# Altium schematic sheet 02_Connectors.SchDoc: Off Board Connectors
size A; Revision: A; SheetNumber: 2; SheetTotal: 4; ECE315_Project_Name: ECE453 F23 Base Project
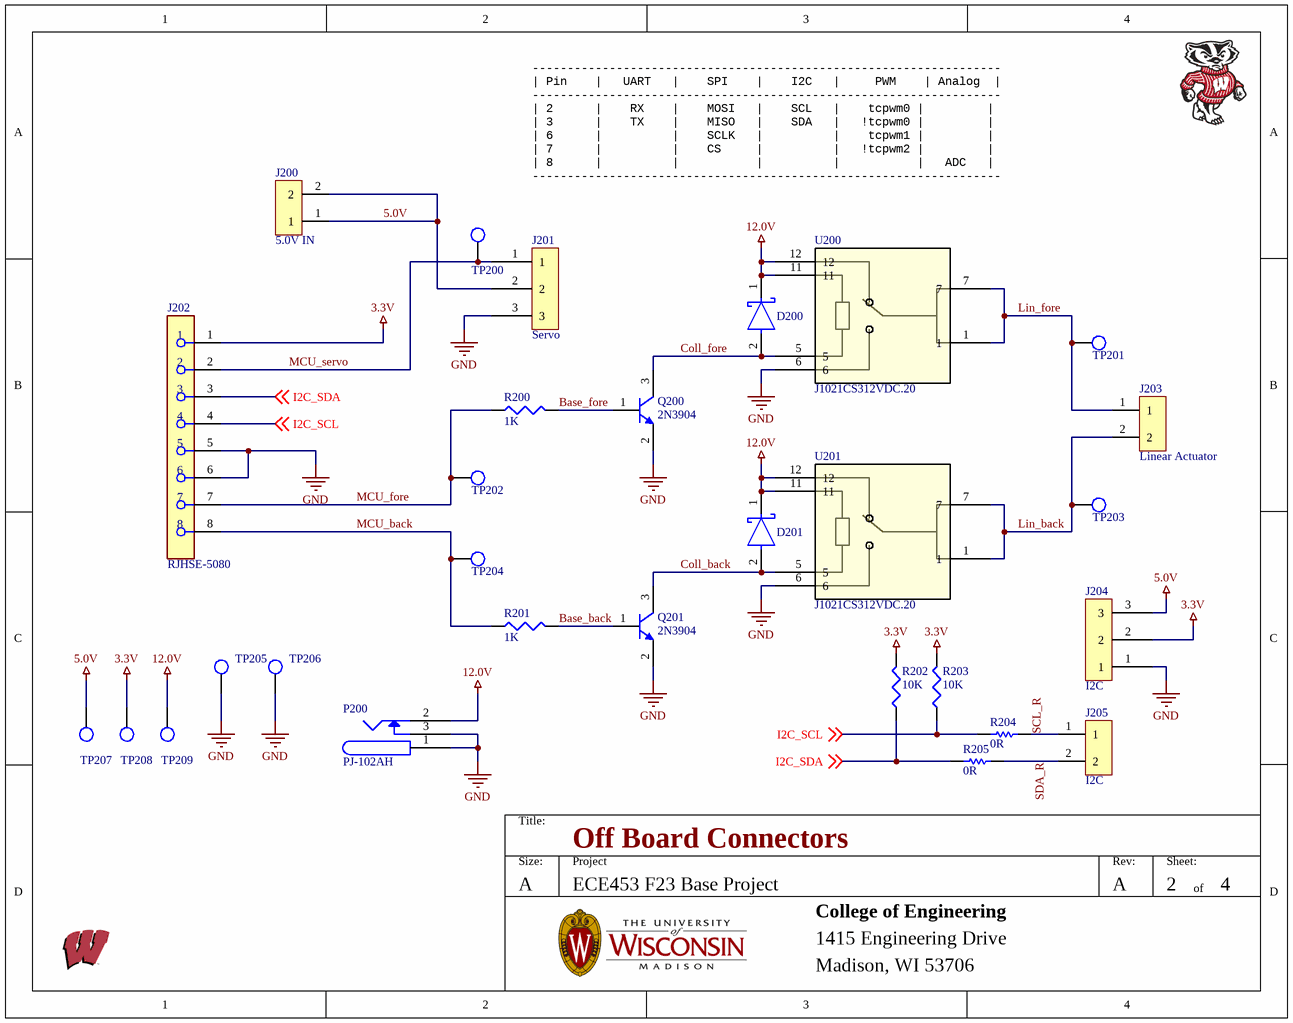
[diagram p0: 02_Connectors.SchDoc]

## Parts
D200  SM5817PL-TP  [On_Semiconductor_425-04_IPC_A]  (value not drawn)
D201  SM5817PL-TP  [On_Semiconductor_425-04_IPC_A]  (value not drawn)
J200  5.0V IN  [PHOENIX2X0.2]
J201  Servo  [PHOENIX3X0.2]
J202  RJHSE-5080  [FP-RJHSE-5080-MFG]
J203  Linear Actuator  [PHOENIX2X0.2]
J204  I2C  [PHOENIX3X0.2]
J205  I2C  [PHOENIX2X0.2]
P200  Manufacturer Part Number: PJ-102AH  [PJ-102]  (hidden comment: PJ-102)
Q200  2N3904  [SOT23-3M]
Q201  2N3904  [SOT23-3M]
R200  value 1K  [RESC2012M]  (hidden comment: 10K)
R201  value 1K  [RESC2012M]  (hidden comment: 10K)
R202  10K  [RESC2012M]
R203  10K  [RESC2012M]
R204  value 0R  [RESC2013X70X40NL20T20]  (hidden comment: ERJ-6GEY0R00V)
R205  value 0R  [RESC2013X70X40NL20T20]  (hidden comment: ERJ-6GEY0R00V)
TP200  TP_1206  [TP-SMC-1206]  (value not drawn)
TP201  TP_1206  [TP-SMC-1206]  (value not drawn)
TP202  TP_1206  [TP-SMC-1206]  (value not drawn)
TP203  TP_1206  [TP-SMC-1206]  (value not drawn)
TP204  TP_1206  [TP-SMC-1206]  (value not drawn)
TP205  TP_1206  [TP-SMC-1206]  (value not drawn)
TP206  TP_1206  [TP-SMC-1206]  (value not drawn)
TP207  TP_1206  [TP-SMC-1206]  (value not drawn)
TP208  TP_1206  [TP-SMC-1206]  (value not drawn)
TP209  TP_1206  [TP-SMC-1206]  (value not drawn)
U200  J1021CS312VDC.20  [RELAY6_J1021CS312VDC.20_CRS]
U201  J1021CS312VDC.20  [RELAY6_J1021CS312VDC.20_CRS]

## Nets
3.3V: J202.1 J204.2 R202.2 R203.2 TP208.1
5.0V: J200.1 J200.2 J201.2 J204.3 TP207.1
12.0V: D200.1(C) D201.1(C) P200.2 TP209.1 U200.11 U200.12 U201.11 U201.12
GND: J201.3 J202.5 J202.6 J204.1 P200.1 P200.3 Q200.2(E) Q201.2(E) TP205.1 TP206.1 U200.6 U201.6
Base_back: Q201.1(B) R201.2
Base_fore: Q200.1(B) R200.2
Coll_back: D201.2(A) Q201.3(C) U201.5
Coll_fore: D200.2(A) Q200.3(C) U200.5
I2C_SCL: J202.4 R203.1 R204.1 ; off-sheet I2C_SCL
I2C_SDA: J202.3 R202.1 R205.1 ; off-sheet I2C_SDA
Lin_back: J203.2 TP203.1 U201.1 U201.7
Lin_fore: J203.1 TP201.1 U200.1 U200.7
MCU_back: J202.8 R201.1 TP204.1
MCU_fore: J202.7 R200.1 TP202.1
MCU_servo: J201.1 J202.2 TP200.1
SCL_R: J205.1 R204.2
SDA_R: J205.2 R205.2

## Notes on the sheet
- -------------------------------------------------------------------
  | Pin    |   UART   |    SPI    |    I2C   |     PWM    | Analog  |
  -------------------------------------------------------------------
  | 2      |    RX    |    MOSI   |    SCL   |    tcpwm0 |         |
  | 3      |    TX    |    MISO   |    SDA   |   !tcpwm0 |         |
  | 6      |          |    SCLK   |          |    tcpwm1 |         |
  | 7      |          |    CS     |          |   !tcpwm2 |         |
  | 8      |          |           |          |           |   ADC   |
  -------------------------------------------------------------------
- Title:
- Size:
- A
- Project
- Rev:
- Sheet:
- of
- College of Engineering
- 1415 Engineering Drive
- Madison, WI 53706

## Library data of the parts
D200 D201 = SM5817PL-TP: DIODE SCHOTTKY 20V 1A SOD123FL; Forward Voltage: 450mV; Max Surge Current: 30A; Element Configuration: Single; Manufacturer 2: MCC; Manufacturer Part Number 2: SM5817PL-TP; RoHS: Yes; Category: Rectifier Diodes; Stock 2: 178040; Pricing 2: 1=0.46000, 10=0.31900, 100=0.16110, 500=0.13144, 1000=0.09752 (USD); Mount: Surface Mount; Number of Pins: 2; Min Operating Temperature: -65°C; Max Operating Temperature: 125°C; Packaging: Tape and Reel; Package Quantity: 1; Average Rectified Current: 1A; Peak Non-Repetitive Surge Current: 30A; Max Reverse Voltage (DC): 20V; Reverse Voltage: 20V; Radiation Hardening: No; RoHS Compliant: Yes; ComponentLink1URL: https://datasheet.ciiva.com/15200/getdatasheetpartid-487494-15200581.pdf?src-supplier=Verical; ComponentLink1Description: https://datasheet.ciiva.com/15200/getdatasheetpartid-487494-15200581.pdf?src-supplier=Verical; ComponentLink2URL: https://datasheet.ciiva.com/912/sm5817pl-sm5819plsod-123fl-912827.pdf?src-supplier=Digi-Key; ComponentLink2Description: https://datasheet.ciiva.com/912/sm5817pl-sm5819plsod-123fl-912827.pdf?src-supplier=Digi-Key; Supplier 1: Digi-Key; Supplier Part Number 1: SM5817PL-TPMSCT-ND
J200 J203 J205 = 2-Pin: 2~24 Poles, Screw Type, Horizontal, 5.08 Pitch, 26~14 (AWG), Terminal Block Connector; Manufacturer: CUI Devices; Manufacturer Part Number: TB006-508-02BE; ComponentLink1URL: https://datasheet.ciiva.com/709/eng-cd-640456-w1-709680.pdf?src-supplier=Digi-Key; ComponentLink1Description: https://datasheet.ciiva.com/709/eng-cd-640456-w1-709680.pdf?src-supplier=Digi-Key; ComponentLink2URL: https://datasheet.ciiva.com/3118/eng-ds-82056-mta-0608-3118497.pdf?src-supplier=Avnet; ComponentLink2Description: https://datasheet.ciiva.com/3118/eng-ds-82056-mta-0608-3118497.pdf?src-supplier=Avnet; ComponentLink3URL: https://datasheet.ciiva.com/16401/eng-ds-82056-mta-0608-16401289.pdf?src-supplier=Future+Electronics; ComponentLink3Description: https://datasheet.ciiva.com/16401/eng-ds-82056-mta-0608-16401289.pdf?src-supplier=Future+Electronics; ComponentLink4URL: https://datasheet.ciiva.com/25617/0900766b80027008-25617244.pdf?src-supplier=RSComponents; ComponentLink4Description: https://datasheet.ciiva.com/25617/0900766b80027008-25617244.pdf?src-supplier=RSComponents; ComponentLink5URL: https://datasheet.ciiva.com/14156/04384301-14156820.pdf?src-supplier=Distrelec; ComponentLink5Description: https://datasheet.ciiva.com/14156/04384301-14156820.pdf?src-supplier=Distrelec; ComponentLink6URL: https://datasheet.ciiva.com/11746/0900766b80eb7fdd-11746365.pdf?src-supplier=RSComponents; ComponentLink6Description: https://datasheet.ciiva.com/11746/0900766b80eb7fdd-11746365.pdf?src-supplier=RSComponents; ComponentLink7URL: https://datasheet.ciiva.com/7128/1866390-7128742.pdf?src-supplier=Newark; ComponentLink7Description: https://datasheet.ciiva.com/7128/1866390-7128742.pdf?src-supplier=Newark; ComponentLink8URL: https://datasheet.ciiva.com/16505/eng-ds-82056-mta-0608-16505419.pdf?src-supplier=Avnet+Asia; ComponentLink8Description: https://datasheet.ciiva.com/16505/eng-ds-82056-mta-0608-16505419.pdf?src-supplier=Avnet+Asia; Supplier: Digi-Key; RoHS: Yes; Category: Terminal Blocks; Stock 1: 50889; Pricing 1: 1=0.86, 10=0.472, 25=0.3524, 50=0.3142, 100=0.308, 250=0.27108, 500=0.24644, 1000=0.2218, 5000=0.16635 (USD); Supplier Part Number: 102-6191-ND
J201 J204 = 3-Pin_2: 2~24 Poles, Screw Type, Horizontal, 5.08 Pitch, 26~14 (AWG), Terminal Block Connector; Manufacturer: CUI Devices; Manufacturer Part Number: TB006-508-03BE; Supplier 1: Digi-Key; Supplier Part Number 1: 102-6192-ND; RoHS: Yes; Category: Terminal Blocks; Stock 1: 41909; Pricing 1: 1=0.91, 10=0.567, 25=0.4856, 50=0.4364, 100=0.4272, 250=0.3636, 500=0.34542, 1000=0.30906, 5000=0.24179 (USD)
J202 = CMP-02366-000003-1: CONN MOD JACK 8P8C R/A UNSHLD; Manufacturer: Amphenol; Current Rating: 1.5A; Voltage Rating: 125V; Pitch: 1.02mm; Conn Orientation: Right Angle; Number Of Contacts: 8; Is Female: yes; Conn Gender: Female; Contact Resistance: 20mR; Number of Ports: 1; Connector Type: RJ45; Lead Free: Yes; Device Class L3: unset; Footprint Url: https://cdn.amphenol-icc.com/media/wysiwyg/files/drawing/rjhse5080.pdf?__cf_chl_jschl_tk__=e349db0bbbb6188a39347cd5e541b92fa02c9719-1587748343-0-AW7tChdeHzRPLX9gSWj7WrKaXQoY9BsmT9Ek0h-T62M9y3Rs9iypFcOtkzb-6sGYQEjFE-jcoNciDETCOZrh1rYyOesac5SvYLoLwHIsHvF4AKBlx-MXmfZUVk9OTTJLqyQq2qMm0PFRLJpNcK0nrKResqOniRSYixG2sPTmOPraH-ULJFBDL602CHqcI9KKBgTq90Jh1OL2Td4moJ99rFsJRJ1Tk_uoxGe8ublcP_ARu-uLpWcQrBcwOcHDTAwL29DAwVaqcH7ta8Ks7WMlHmVl_pILeEDwT0bE9vu5Pa5S3PtNRF1leuFkgi_FMbUxTDulc5xzbXSfng8srUIV1lWXny5nx1fZJEUa_w97yKjffzBMxiWLWVN-V7-uqAaPbyv_m-wRyw5O25OZNyJOeGU; ComponentLink2URL: https://cdn.amphenol-icc.com/media/wysiwyg/files/documentation/datasheet/inputoutput/io-modjack-rjhse.pdf; Device Class L1: Connectors; Package: CONN_MOD_JACK; Mouser Description: Modular Connectors / Ethernet Connectors R/A RJ45 NONSHIELDED 8 CONT NO LEDS; Manufacturer Part Number: RJHSE-5080; Octopart: https://octopart.com/rjhse-5080-amphenol-45060; Category: Conn; Height: 0.535inch; Temperature: -55°C to +85°C; Digikey Description: CONN MOD JACK 8P8C R/A UNSHLD; Device Class L2: Modular / Ethernet Connectors; Contact Material: Gold,Nickel; ComponentLink2Description: Datasheet; Temperature Range Low: -55°C; RoHS: TRUE; Automotive: No; Temperature Range High: +85°C; Supplier: Newark; Supplier Part Number: 28T0105; Stock: 8640; Pricing: 1=0.966, 10=0.854, 25=0.808, 50=0.777, 100=0.748, 250=0.688, 500=0.627, 1000=0.568 (USD); Mounting Technology: Through Hole,Panel; Contact Plating: Gold; Max Current Rating: 1.5A; Number of Positions Loaded: 8; Max Voltage Rating (AC): 125V; Orientation: Right Angle; Packaging: Rail/Tube; Gender: Female; Termination: Solder; Number of Positions: 8; Voltage Rating (DC): 125V; Length: 15.75mm; Depth: 14.99mm; Radiation Hardening: No; RoHS Compliant: Yes; Reach SVHC Compliant: Unknown; ComponentLink1URL: https://datasheet.ciiva.com/7629/1682821-7629402.pdf?src-supplier=Element14; ComponentLink1Description: https://datasheet.ciiva.com/7629/1682821-7629402.pdf?src-supplier=Element14; ComponentLink3URL: https://datasheet.ciiva.com/685/rjhse5080-685586.pdf?src-supplier=Digi-Key; ComponentLink3Description: https://datasheet.ciiva.com/685/rjhse5080-685586.pdf?src-supplier=Digi-Key; ComponentLink4URL: https://datasheet.ciiva.com/1432/1693748-1432448.pdf?src-supplier=Element14; ComponentLink4Description: https://datasheet.ciiva.com/1432/1693748-1432448.pdf?src-supplier=Element14; ComponentLink5URL: https://datasheet.ciiva.com/15171/getdatasheetpartid-643190-15171163.pdf?src-supplier=Verical; ComponentLink5Description: https://datasheet.ciiva.com/15171/getdatasheetpartid-643190-15171163.pdf?src-supplier=Verical
P200 = CONN JACK PWR W/SW: CONN PWR JACK 2.1X5.5MM HIGH CUR; Manufacturer: CUI Inc; Internal Switch(s): Single Switch, Normally Closed; Number of Positions/Contacts: 2 Conductors, 3 Contacts; Plug/Mating Plug Diameter: 2.1mm ID, 5.5mm OD; Gender: Male; Shielding: Unshielded; Voltage - Rated: 24VDC; Current Rating: 5A; Value: CP-102AD; Mounting Type: Through Hole, Right Angle; Supplier: Digi-Key; Connector Type: Jack; Supplier Part Number: CP-102AH-ND; Termination: Solder; Contact Material: Copper; Housing Material: Thermoplastic; Contact Material - Plating: Nickel; Housing Color: Black; Operating Temperature: -25°C ~ 85°C; Color: Black
Q200 Q201 = 2N3904: NPN General Purpose Amplifier; Manufacturer Part Number: MMBT3904-7-F; Manufacturer: Diodes Incorporated; Frequency - Transition: 300MHz; Power - Max: 300mW; DC Current Gain (hFE) (Min) @ Ic, Vce: 100 @ 10mA, 1V; Current - Collector Cutoff (Max): 50nA (ICBO); Vce Saturation (Max) @ Ib, Ic: 300mV @ 5mA, 50mA; Voltage - Collector Emitter Breakdown (Max): 40V; Current - Collector (Ic) (Max): 200mA; Supplier Device Package: SOT-23-3; Mounting Type: Surface Mount; Transistor Type: NPN; Packaging: Cut Tape (CT); RoHS: RoHS Compliant; Package / Case: TO-236-3, SC-59, SOT-23-3; Supplier Part Number: MMBT3904-FDICT-ND; Supplier: Digi-Key; Category: Discrete Semiconductor Products; Value: 2N3904
R200 R201 = Res3_1: Res Thick Film 0805 1K Ohm 1% 0.125W(1/8W) ±100ppm/C Pad SMD Automotive T/R; Manufacturer: Stackpole Electronics; Manufacturer Part Number: RMCF0805FT1K00; Power Rating: 125mW; Temperature Coefficient: 100ppm/°C; Supplier 1: Digi-Key; Supplier Part Number 1: RMCF0805FT1K00CT-ND; RoHS: Yes; Category: Chip SMD Resistors; Stock 1: 2773085; Pricing 1: 1=0.10000, 10=0.02400, 100=0.00970, 1000=0.00437, 2500=0.00379 (USD); Mounting Technology: Surface Mount; Case/Package: 0805; Case Code (Metric): 2012; Case Code (Imperial): 0805; Contact Plating: Tin,Matte; Min Operating Temperature: -55°C; Max Operating Temperature: 155°C; Tolerance: 1%; Packaging: Tape and Reel; Resistor Type: Thick Film; Number of Terminations: 2; Max Power Dissipation: 125mW; Features: Automotive AEC-Q200; Series: RMCF; Construction: Rectangular; Length: 2mm; Width: 0.049inch; Height: 0.026inch; Depth: 1.25mm; Radiation Hardening: No; Military Standard: Not; Lead Free: Lead Free; RoHS Compliant: Yes; ComponentLink1URL: https://datasheet.ciiva.com/15193/getdatasheetpartid-360136-15193546.pdf?src-supplier=Verical; ComponentLink1Description: https://datasheet.ciiva.com/15193/getdatasheetpartid-360136-15193546.pdf?src-supplier=Verical
R202 R203 = Res3: Res Thick Film 0805 10K Ohm 1% 0.125W ±100ppm/°C Molded SMD Paper T/R; Manufacturer: Stackpole Electronics; Manufacturer Part Number: RMCF0805FT10K0; Power Rating: 125mW; ComponentLink1URL: https://datasheet.ciiva.com/15193/getdatasheetpartid-362046-15193525.pdf?src-supplier=Verical; ComponentLink1Description: https://datasheet.ciiva.com/15193/getdatasheetpartid-362046-15193525.pdf?src-supplier=Verical; Supplier 1: Digi-Key; Supplier Part Number 1: RMCF0805FT10K0CT-ND; RoHS: Yes; Category: Chip SMD Resistors; Stock 1: 3732463; Pricing 1: 1=0.10000, 10=0.02400, 100=0.00970, 1000=0.00437, 2500=0.00379 (USD); Mounting Technology: Surface Mount; Case/Package: 0805; Case Code (Metric): 2012; Case Code (Imperial): 0805; Contact Plating: Tin,Matte; Min Operating Temperature: -55°C; Max Operating Temperature: 155°C; Tolerance: 1%; Packaging: Tape and Reel; Resistor Type: Thick Film; Number of Terminations: 2; Temperature Coefficient: 100ppm/°C; Max Power Dissipation: 125mW; Features: Automotive AEC-Q200; Series: RMCF; Construction: Rectangular; Length: 2mm; Width: 0.049inch; Height: 0.026inch; Depth: 1.25mm; Radiation Hardening: No; Lead Free: Lead Free; Military Standard: Not; RoHS Compliant: Yes; Value: 10K
R204 R205 = CMP-1665-00002-5: Chip Resistor, 0 Ohm, +/- 1%, 0.125 W, -55 to 155 degC, 0805 (2012 Metric), RoHS, Tape and Reel; Manufacturer: Panasonic; Tolerance: 5%; Resistance: 0 Ohm; Power Rating: 125mW; Temperature Coefficient: 600ppm/°C; Voltage Rating: 150V; Current Rating: 2A; REACH SVHC: No SVHC; Min Operating Temperature: -55 degC; Case/Package: 0805; Packaging: Tape and Reel; Package Quantity: 5000; ComponentLink1Description: Manufacturer URL; PackageDescription: 2-Pin Surface Mount Device, Body 2 x 1.25 mm; Mounting Technology: Surface Mount; Max Operating Temperature: 155 degC; PartNumber: ERJ-6GEY0R00V; Width: 1.25 mm; RoHSCompliant: True; Height: 0.6 mm; ComponentLink1URL: http://www.panasonic.com/; ComponentLink2URL: http://industrial.panasonic.com/cdbs/www-data/pdf/RDA0000/AOA0000C84.pdf; Case Code (Imperial): 0805; DatasheetVersion: 03/2015; Length: 2 mm; Case Code (Metric): 2012; ComponentLink2Description: Datasheet; Radiation Hardening: No; Supplier: Newark; Supplier Part Number: 65T8846; Manufacturer Part Number: ERJ-6GEY0R00V; RoHS: Yes; Category: Chip SMD Resistors; Stock: 200593; Pricing: 1=0.008, 25=0.008, 50=0.008, 100=0.008, 250=0.008, 500=0.008, 1000=0.008 (USD); Contact Plating: Tin; Series: ERJ; Termination: SMD/SMT; Resistor Type: Thick Film; Number of Terminations: 2; Technology: THICK FILM; Construction: Rectangular; Max Power Dissipation: 125mW; Voltage Rating (DC): 150V; Features: Automotive AEC-Q200; Depth: 1.25mm; Ratings: AEC-Q200; RoHS Compliant: Yes; Reach SVHC Compliant: No; Military Standard: Not; Lead Free: Lead Free
TP200-TP209 = TP_1206: Test Point SMD 1206; Manufacturer: TE Connectivity (Tyco Electronics); Manufacturer Part Number: 1625854-1; Resistance Value: 0 Ohm; Temperature Coefficient: N/R; Supplier: Digi-Key; Stock 1: 31937; Pricing 1: 1=0.28, 10=0.261, 25=0.224, 50=0.1902, 100=0.1828, 250=0.1641, 500=0.1567, 1000=0.1306 (USD); Case Size: 1206; Dimension: 3.2 x 1.6 x 1.25mm; Family: RC; Mounting: Surface Mount; Operating Temperature: -55 to 125 C; Part No: 1625854-1; RoHS: Yes; Packaging: Tape and Reel; Termination Style: N/R; Terminal Pitch: N/R; Power Rating: N/R; Tolerance: N/R; ComponentLink1URL: https://datasheet.ciiva.com/6439/eng-ds-1773266-a-6439169.pdf; ComponentLink1Description: https://datasheet.ciiva.com/6439/eng-ds-1773266-a-6439169.pdf; ComponentLink2URL: https://datasheet.ciiva.com/30136/1773266-a-30136341.pdf; ComponentLink2Description: https://datasheet.ciiva.com/30136/1773266-a-30136341.pdf; ComponentLink3URL: https://datasheet.ciiva.com/6439/eng-ds-1773266-a-6439080.pdf; ComponentLink3Description: https://datasheet.ciiva.com/6439/eng-ds-1773266-a-6439080.pdf; ComponentLink4URL: https://datasheet.ciiva.com/6439/eng-ds-1773266-a-6439081.pdf; ComponentLink4Description: https://datasheet.ciiva.com/6439/eng-ds-1773266-a-6439081.pdf; ComponentLink5URL: https://datasheet.ciiva.com/6439/eng-ds-1773266-a-6439083.pdf; ComponentLink5Description: https://datasheet.ciiva.com/6439/eng-ds-1773266-a-6439083.pdf; Supplier Part Number: A106143CT-ND
U200 U201 = J1021CS312VDC.20: No Description Available; Mfr_Name: CIT Relay & Switch; Copyright: Copyright (C) 2023 Ultra Librarian. All rights reserved.; Manufacturer_Part_Number: J1021CS312VDC.20; RefDes: RefDes; Type: DEV